# Altium schematic sheet 4d - BSPD Detection Timer.SchDoc
size A4
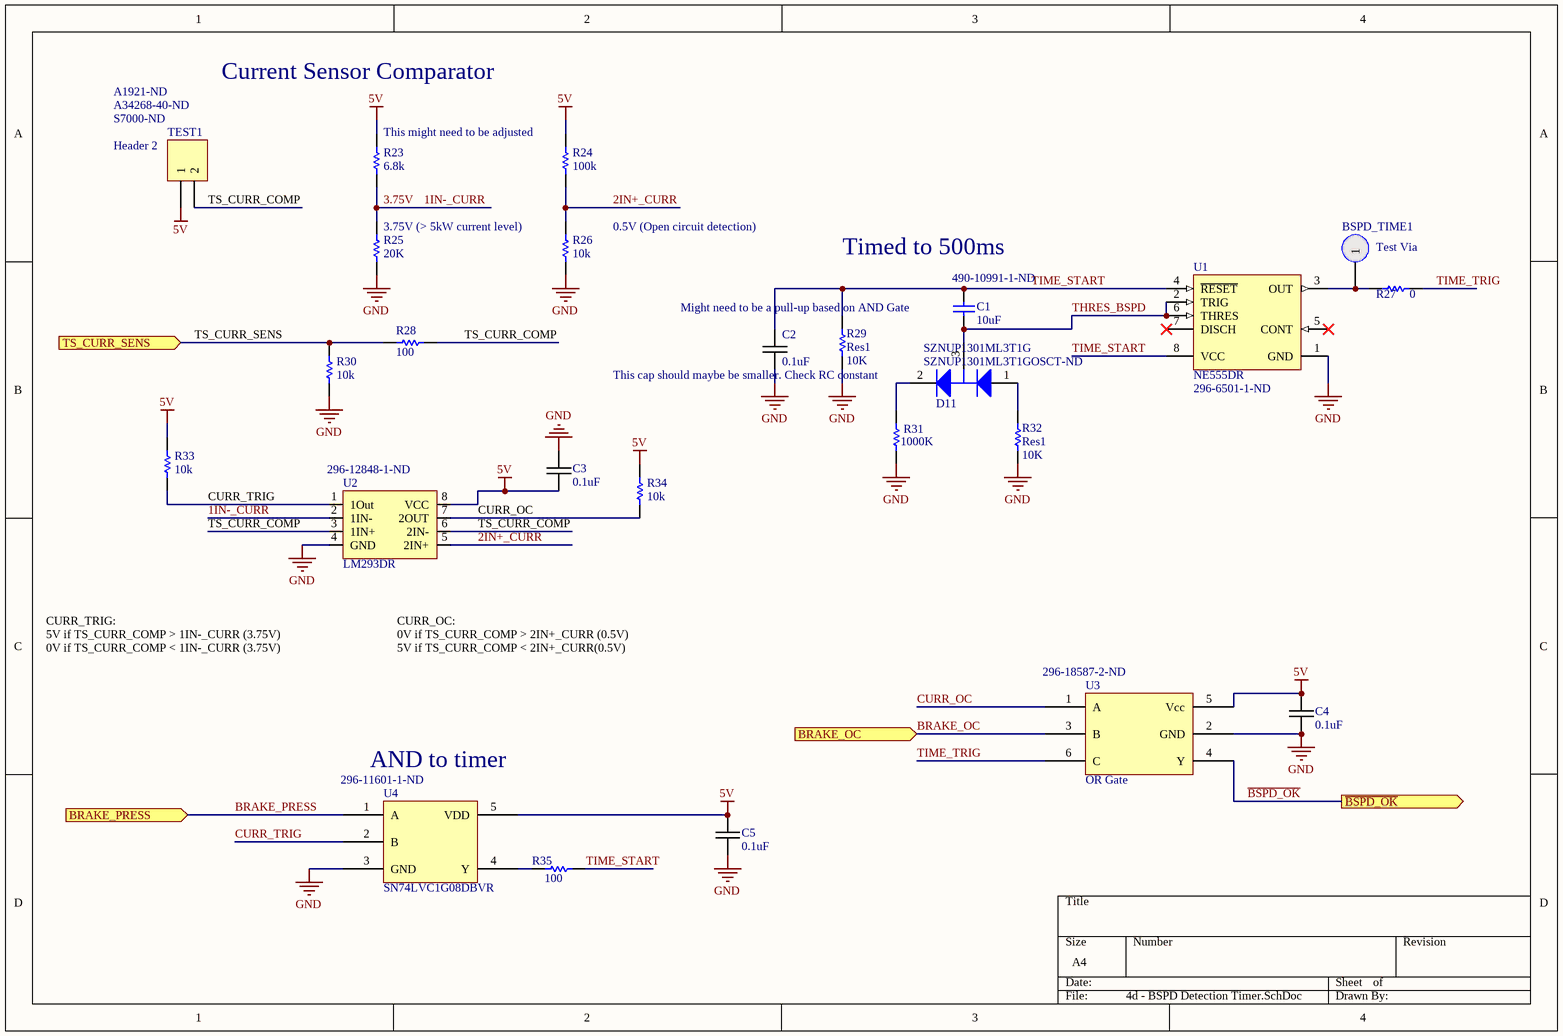
[diagram p0: 4d - BSPD Detection Timer.SchDoc]

## Parts
BSPD_TIME1  Test Via  [Test Via]
C1  value 10uF  Supplier Part Number 1: 490-10991-1-ND  [1608[0603]]  (hidden comment: Cap Semi)
C2  value 0.1uF  [1608[0603]]  (hidden comment: 100nF)
C3  value 0.1uF  [1608[0603]]  (hidden comment: 100nF)
C4  value 0.1uF  [1608[0603]]  (hidden comment: 100nF)
C5  value 0.1uF  [1608[0603]]  (hidden comment: 100nF)
D11  SZNUP1301ML3T1G  Supplier Part Number 1: SZNUP1301ML3T1GOSCT-ND  [ONSC-SOT-23-3-318-08_V]
R23  Resistance (Ohms): 6.8k  [1608[0603]]  (hidden comment: Volt. Div. R1)
R24  Resistance (Ohms): 100k  [1608[0603]]  (hidden comment: Volt. Div. R1)
R25  value 20K  [1608[0603]]  (hidden comment: Volt. Div. R2)
R26  value 10k  [1608[0603]]  (hidden comment: Volt. Div. R2)
R27  value 0  [1608[0603]]  (hidden comment: Volt. Div. R1)
R28  value 100  [1608[0603]]  (hidden comment: Volt. Div. R2)
R29  Res1  value 10K  [1608[0603]]
R30  value 10k  [1608[0603]]  (hidden comment: Volt. Div. R2)
R31  1000K  [RESC0603(1608)_L]
R32  Res1  value 10K  [1608[0603]]
R33  value 10k  [1608[0603]]  (hidden comment: Volt. Div. R2)
R34  value 10k  [1608[0603]]  (hidden comment: Volt. Div. R2)
R35  value 100  [1608[0603]]  (hidden comment: Volt. Div. R2)
TEST1  Header 2  Supplier Part Number 1: S7000-ND  Supplier Part Number 2: A34268-40-ND  Supplier Part Number 3: A1921-ND  [2 Pin Connector]
U1  NE555DR  Supplier Part Number 1: 296-6501-1-ND  [D0008A_M]
U2  LM293DR  Supplier Part Number 1: 296-12848-1-ND  [LM293DR]
U3  OR Gate  Supplier Part Number 1: 296-18587-2-ND  [SOT23-6_M]
U4  SN74LVC1G08DBVR  Supplier Part Number 1: 296-11601-1-ND  [SSOP5-P-0.95]

## Ports
BRAKE_OC (in), BRAKE_PRESS (in), TS_CURR_SENS (in), ~{BSPD_OK} (out)

## Nets
5V: C3.1 C4.1 C5.1 R23.2 R24.2 R33.2 R34.2 TEST1.1 U2.8(VCC) U3.5(Vcc) U4.5(VDD)
GND: C2.2 C3.2 C4.2 C5.2 R25.1 R26.1 R29.1 R30.1 R31.1 R32.1 U1.1(GND) U2.4(GND) U3.2(GND) U4.3(GND)
1IN-_CURR: R23.1 R25.2 U2.2(1IN-)  [also labelled 3.75V]
2IN+_CURR: R24.1 R26.2 U2.5(2IN+)
~{BSPD_OK}: U3.4(Y) ; port ~{BSPD_OK}
BRAKE_OC: U3.3(B) ; port BRAKE_OC
BRAKE_PRESS: U4.1(A) ; port BRAKE_PRESS
CURR_OC: R34.1 U2.7(2OUT) U3.1(A)
CURR_TRIG: R33.1 U2.1(1Out) U4.2(B)
THRES_BSPD: C1.1 D11.3(K/A) U1.2(TRIG) U1.6(THRES)
TIME_START: C1.2 C2.1 R29.2 R35.1 U1.4(~{RESET}) U1.8(VCC)
TIME_TRIG: R27.1 U3.6(C)
TS_CURR_COMP: R28.1 TEST1.2 U2.3(1IN+) U2.6(2IN-)
TS_CURR_SENS: R28.2 R30.2 ; port TS_CURR_SENS
NetBSPD_TIME1_1: BSPD_TIME1.1 R27.2 U1.3(OUT)
NetD11_1: D11.1(A) R32.2
NetD11_2: D11.2(K) R31.2
NetR35_2: R35.2 U4.4(Y)

Not connected (* = marked no-connect by the designer): U1 5(CONT)* 7(DISCH)*

## Notes on the sheet
- Current Sensor Comparator
- This might need to be adjusted
- (near R25) 3.75V (> 5kW current level)
- 0.5V (Open circuit detection)
- Might need to be a pull-up based on AND Gate
- (near C1) Timed to 500ms
- This cap should maybe be smaller. Check RC constant
- CURR_TRIG:
  5V if TS_CURR_COMP > 1IN-_CURR (3.75V)
  0V if TS_CURR_COMP < 1IN-_CURR (3.75V)
- CURR_OC:
  0V if TS_CURR_COMP > 2IN+_CURR (0.5V)
  5V if TS_CURR_COMP < 2IN+_CURR(0.5V)
- (near U4) AND to timer

## Library data of the parts
C1 = Cap Semi: Capacitor (Semiconductor SIM Model); Published: 8-Jun-2000; LatestRevisionDate: 29-May-2009; LatestRevisionNote: IPC-7351 Footprint Added.; PackageReference: C1206; Publisher: Altium Limited; PackageDescription: Chip Capacitor; Supplier 1: Digi-Key
C2-C5 = 0805C-100nF-25V-X7R-MUR: CAP CER 0.1UF 50V X7R 0603; Manufacturer: Kemet; Manufacturer Part Number: C0603C104K5RACAUTO; Capacitance: 0.1µF; Tolerance: ±10%; Supplier 1: Digi-Key; RoHS: RoHS Compliant; Category: Capacitors; Stock 1: 157876; Pricing 1: 1=0.14, 10=0.095, 25=0.0672, 50=0.0514, 100=0.0435, 250=0.03556, 1000=0.02324 (CAD); Packaging: Cut Tape (CT); Voltage - Rated: 50V; Temperature Coefficient: X7R; Mounting Type: Surface Mount, MLCC; Operating Temperature: -55°C ~ 125°C; Applications: Automotive; Ratings: AEC-Q200; Package / Case: 0603 (1608 Metric); Size / Dimension: 0.063" L x 0.031" W (1.60mm x 0.80mm); Height - Seated (Max): -; Thickness (Max): 0.034" (0.87mm); Lead Spacing: -; Features: -; Lead Style: -; ComponentLink1URL: http://capacitoredge.kemet.com/capedge2/DataSheet?pn=C0603C104K5RACAUTO; ComponentLink1Description: http://capacitoredge.kemet.com/capedge2/DataSheet?pn=C0603C104K5RACAUTO
  C2 C4 C5: Supplier Part Number 1: 399-6856-1-ND
D11 = CMP-1063-00171-1: Low Capacitance Diode Array for ESD Protection in a Single Data Line, 3-Pin SOT-23, Pb-Free, Tape and Reel; Manufacturer: On Semiconductor; C Max (pF): 0.9; Direction: Bidirectional; V(BR) Min (V): 70; Number of Lines: 1; Mounting Technology: Surface Mount; PackageReference: SOT-23-3-318-08; DatasheetVersion: Rev. 6; PackageVersion: Rev. AP, 11/2009; RoHS: Pb-Free; ComponentLink1Description: Manufacturer URL; ComponentLink1URL: http://www.onsemi.com/; PackageDescription: 3-Pin Small Outline Transistor, Body 2.92 x 1.3 mm, Pitch 0.95 mm; PartNumber: SZNUP1301ML3T1G; Packing: Tape and Reel; ComponentLink3URL: http://www.onsemi.cn/pub_link/Collateral/318-08.PDF; ComponentLink3Description: Package Specification; VRWM Max (V): 70; ComponentLink2Description: Datasheet; ComponentLink2URL: http://www.onsemi.cn/pub_link/Collateral/NUP1301ML3T1-D.PDF; Supplier 1: Digi-Key
R23 R24 = Res1: RES SMD 6.8K OHM 5% 1/4W 0603; Manufacturer: Rohm Semiconductor; Manufacturer Part Number: ESR03EZPJ682; Power (Watts): 0.25W, 1/4W; Temperature Coefficient: ±200ppm/°C; RoHS: RoHS Compliant; Category: Resistors; Stock 1: 2440; Pricing 1: 1=0.15, 10=0.119, 25=0.0824, 50=0.0642, 100=0.0458, 250=0.03568, 500=0.02836, 1000=0.02012 (CAD); Packaging: Cut Tape (CT); Part Status: Active; Tolerance: ±5%; Composition: Thick Film; Features: Automotive AEC-Q200, Pulse Withstanding; Operating Temperature: -55°C ~ 155°C; Package / Case: 0603 (1608 Metric); Supplier Device Package: 0603; Size / Dimension: 0.063" L x 0.031" W (1.60mm x 0.80mm); Height - Seated (Max): 0.022" (0.55mm); Failure Rate: -; ComponentLink1URL: http://rohmfs.rohm.com/en/products/databook/datasheet/passive/resistor/chip_resistor/esr.pdf; ComponentLink1Description: http://rohmfs.rohm.com/en/products/databook/datasheet/passive/resistor/chip_resistor/esr.pdf; Supplier 1: Digi-Key
  R23: Supplier Part Number 1: 311-6.8KGRCT-ND
  R24: Supplier Part Number 1: 311-100KHRCT-ND
R25 R26 R28 R30 R33-R35 = Res1: RES SMD 20K OHM 5% 1/4W 0603; Manufacturer: Rohm Semiconductor; Manufacturer Part Number: ESR03EZPJ203; Power (Watts): 0.25W, 1/4W; Temperature Coefficient: ±200ppm/°C; Published: 8-Jun-2000; LatestRevisionDate: 17-Jul-2002; LatestRevisionNote: Re-released for DXP Platform.; PackageReference: AXIAL-0.3; Publisher: Altium Limited; PackageDescription: Axial Device, Thru-Hole; 2 Leads; 0.3 in Pin Spacing; RoHS: RoHS Compliant; Category: Resistors; Stock 1: 50602; Pricing 1: 1=0.15, 10=0.121, 25=0.0832, 100=0.0463, 250=0.03604, 500=0.02866, 1000=0.02033 (CAD); Packaging: Cut Tape (CT); Resistance (Ohms): 20k; Tolerance: ±5%; Composition: Thick Film; Features: Automotive AEC-Q200, Pulse Withstanding; Operating Temperature: -55°C ~ 155°C; Package / Case: 0603 (1608 Metric); Supplier Device Package: 0603 (1608 Metric); Size / Dimension: 0.063" L x 0.031" W (1.60mm x 0.80mm); Height: 0.022" (0.55mm); Number of Terminations: 2; ComponentLink1URL: http://rohmfs.rohm.com/en/products/databook/datasheet/passive/resistor/chip_resistor/esr.pdf; ComponentLink1Description: http://rohmfs.rohm.com/en/products/databook/datasheet/passive/resistor/chip_resistor/esr.pdf; Supplier 1: Digi-Key
  R25: Supplier Part Number 1: 311-20.0KHRCT-ND
  R26 R30 R33 R34: Supplier Part Number 1: 311-10KGRCT-ND
  R28 R35: Supplier Part Number 1: 311-100HRDKR-ND
R27 = Res1: RES SMD 0.0 OHM JUMPER 1/4W 0603; Manufacturer: Vishay Dale; Manufacturer Part Number: CRCW06030000Z0EAHP; Resistance (Ohms): 0.0; Power (Watts): 0.25W, 1/4W; Published: 8-Jun-2000; LatestRevisionDate: 17-Jul-2002; LatestRevisionNote: Re-released for DXP Platform.; PackageReference: AXIAL-0.3; Publisher: Altium Limited; PackageDescription: Axial Device, Thru-Hole; 2 Leads; 0.3 in Pin Spacing; RoHS: RoHS Compliant; Category: Resistors; Stock 1: 378250; Pricing 1: 1=0.32, 10=0.272, 25=0.1972, 50=0.1432, 100=0.1062, 250=0.08152, 500=0.06422, 1000=0.04446, 2500=0.04075 (CAD); Packaging: Cut Tape (CT); Tolerance: Jumper; Composition: Thick Film; Features: Automotive AEC-Q200, Pulse Withstanding; Temperature Coefficient: -; Operating Temperature: -55°C ~ 155°C; Package / Case: 0603 (1608 Metric); Supplier Device Package: 0603 (1608 Metric); Size / Dimension: 0.063" L x 0.033" W (1.60mm x 0.85mm); Height: 0.022" (0.55mm); Number of Terminations: 2; ComponentLink1URL: http://www.vishay.com/docs/20043/crcwhpe3.pdf; ComponentLink1Description: http://www.vishay.com/docs/20043/crcwhpe3.pdf; Supplier 1: Digi-Key; Supplier Part Number 1: 311-0.0GRCT-ND
R29 R32 = Res1: RES SMD 10K OHM 5% 1/4W 0603; Manufacturer: Rohm Semiconductor; Manufacturer Part Number: ESR03EZPJ103; Power (Watts): 0.25W, 1/4W; Temperature Coefficient: ±200ppm/°C; Published: 8-Jun-2000; LatestRevisionDate: 17-Jul-2002; LatestRevisionNote: Re-released for DXP Platform.; PackageReference: AXIAL-0.3; Publisher: Altium Limited; PackageDescription: Axial Device, Thru-Hole; 2 Leads; 0.3 in Pin Spacing; RoHS: RoHS Compliant; Category: Resistors; Stock 1: 0; Pricing 1: 1=0.15, 10=0.119, 25=0.0824, 50=0.0642, 100=0.0458, 250=0.03568, 500=0.02836, 1000=0.02012 (CAD); Packaging: Cut Tape (CT); Part Status: Active; Resistance (Ohms): 10k; Tolerance: ±5%; Composition: Thick Film; Features: Automotive AEC-Q200, Pulse Withstanding; Operating Temperature: -55°C ~ 155°C; Package / Case: 0603 (1608 Metric); Supplier Device Package: 0603; Size / Dimension: 0.063" L x 0.031" W (1.60mm x 0.80mm); Height - Seated (Max): 0.022" (0.55mm); Failure Rate: -; ComponentLink1URL: http://rohmfs.rohm.com/en/products/databook/datasheet/passive/resistor/chip_resistor/esr.pdf; ComponentLink1Description: http://rohmfs.rohm.com/en/products/databook/datasheet/passive/resistor/chip_resistor/esr.pdf; Supplier 1: Digi-Key; Supplier Part Number 1: 311-10KGRCT-ND
R31 = CMP-1591-00001-1: 0603 (1608 Metric) Chip Resistor; Case-Metric: 1608; Case-EIA: 0603; PackageReference: RESC0603(1608); Supplier 1: Digi-Key; Supplier Part Number 1: 311-1.00MHRCT-ND
TEST1 = Header 2: Header, 2-Pin; Manufacturer: Harwin Inc.; Manufacturer Part Number: M20-9990246; Connector Type: Header, Cuttable; Pitch - Mating: 0.100" (2.54mm); Style: Board to Board or Cable; Shrouding: Unshrouded; Number of Positions: 2; Number of Positions Loaded: All; Contact Length - Mating: 0.240" (6.10mm); Contact Length - Post: 0.118" (3.00mm); Overall Contact Length: 0.460" (11.68mm); Material Flammability Rating: UL94 V-0; Current Rating: 3A per Contact; Mated Stacking Heights: 10.04mm, 10.64mm, 11.04mm, 16.54mm; LatestRevisionDate: 17-Jul-2002; LatestRevisionNote: Re-released for DXP Platform.; Publisher: Altium Limited; RoHS: RoHS Compliant; Category: Connectors, Interconnects; Packaging: Bulk; Part Status: Active; Contact Type: Male Pin; Number of Rows: 1; Row Spacing - Mating: -; Mounting Type: Through Hole; Termination: Solder; Fastening Type: Push-Pull; Insulation Height: 0.100" (2.54mm); Contact Shape: Square; Contact Finish - Mating: Tin; Contact Finish Thickness - Mating: -; Contact Finish - Post: Tin; Contact Material: Brass; Insulation Material: Polyamide (PA6T), Nylon 6T; Features: -; Operating Temperature: -40°C ~ 105°C; Ingress Protection: -; Insulation Color: Black; Voltage Rating: -; Contact Finish Thickness - Post: -; Applications: -; ComponentLink1URL: https://cdn.harwin.com/pdfs/M20-999.pdf; ComponentLink1Description: https://cdn.harwin.com/pdfs/M20-999.pdf; Supplier 1: Digi-Key; Supplier 2: Digi-Key; Supplier 3: Digi-Key
U1 = CMP-1685-00007-1: Precision Timer, 4.5 to 16 V, 0 to 70 degC, 8-Pin SOIC (D8), Green (RoHS & no Sb/Br), Tape and Reel; Forward Voltage: 450 mV; Forward Current: 1 A; Max Surge Current: 30 A; Peak Reverse Current: 500 uA; Case\Package: SMA; PackageReference: D0008A; Width: 2.84 mm; PackageDescription: 8-Pin Small Outline Integrated Circuit, Body 4.9 x 3.9 mm, Pitch 1.27 mm; DatasheetVersion: SLFS022I, 09/2014; ComponentLink2Description: Datasheet; Package Quantity: 1; REACH SVHC: Unknown; Radiation Hardening: No; Height: 2.44 mm; Code_JEDEC: MS-012; Pins: 2; ComponentLink1Description: Manufacturer URL; ComponentLink3Description: Package Specification; ComponentLink3URL: http://www.ti.com/lit/ml/msoi002j/msoi002j.pdf; Length: 4.57 mm; ComponentLink1URL: http://www.ti.com/; Mount: Surface Mount; PackageVersion: 4040047-3/M, 06/2011; ComponentLink2URL: http://www.ti.com/general/docs/lit/getliterature.tsp?genericPartNumber=NE555&fileType=pdf; RoHSCompliant: true; Max Operating Temperature: 125 degC; Packaging: Cut Tape; Min Operating Temperature: -55 degC; Supplier 1: Digi-Key
U2 = LM293DR: IC Dual Comparator; Supplier 1: Digi-Key
U3 = 4-input OR Gate: Supplier 1: Digi-Key
U4 = SN74LVC1G08DBVR: Supplier 1: Digi-Key